# EAGLE design AutoPilotPanel - Part 2 (EAGLE 8.3.1)
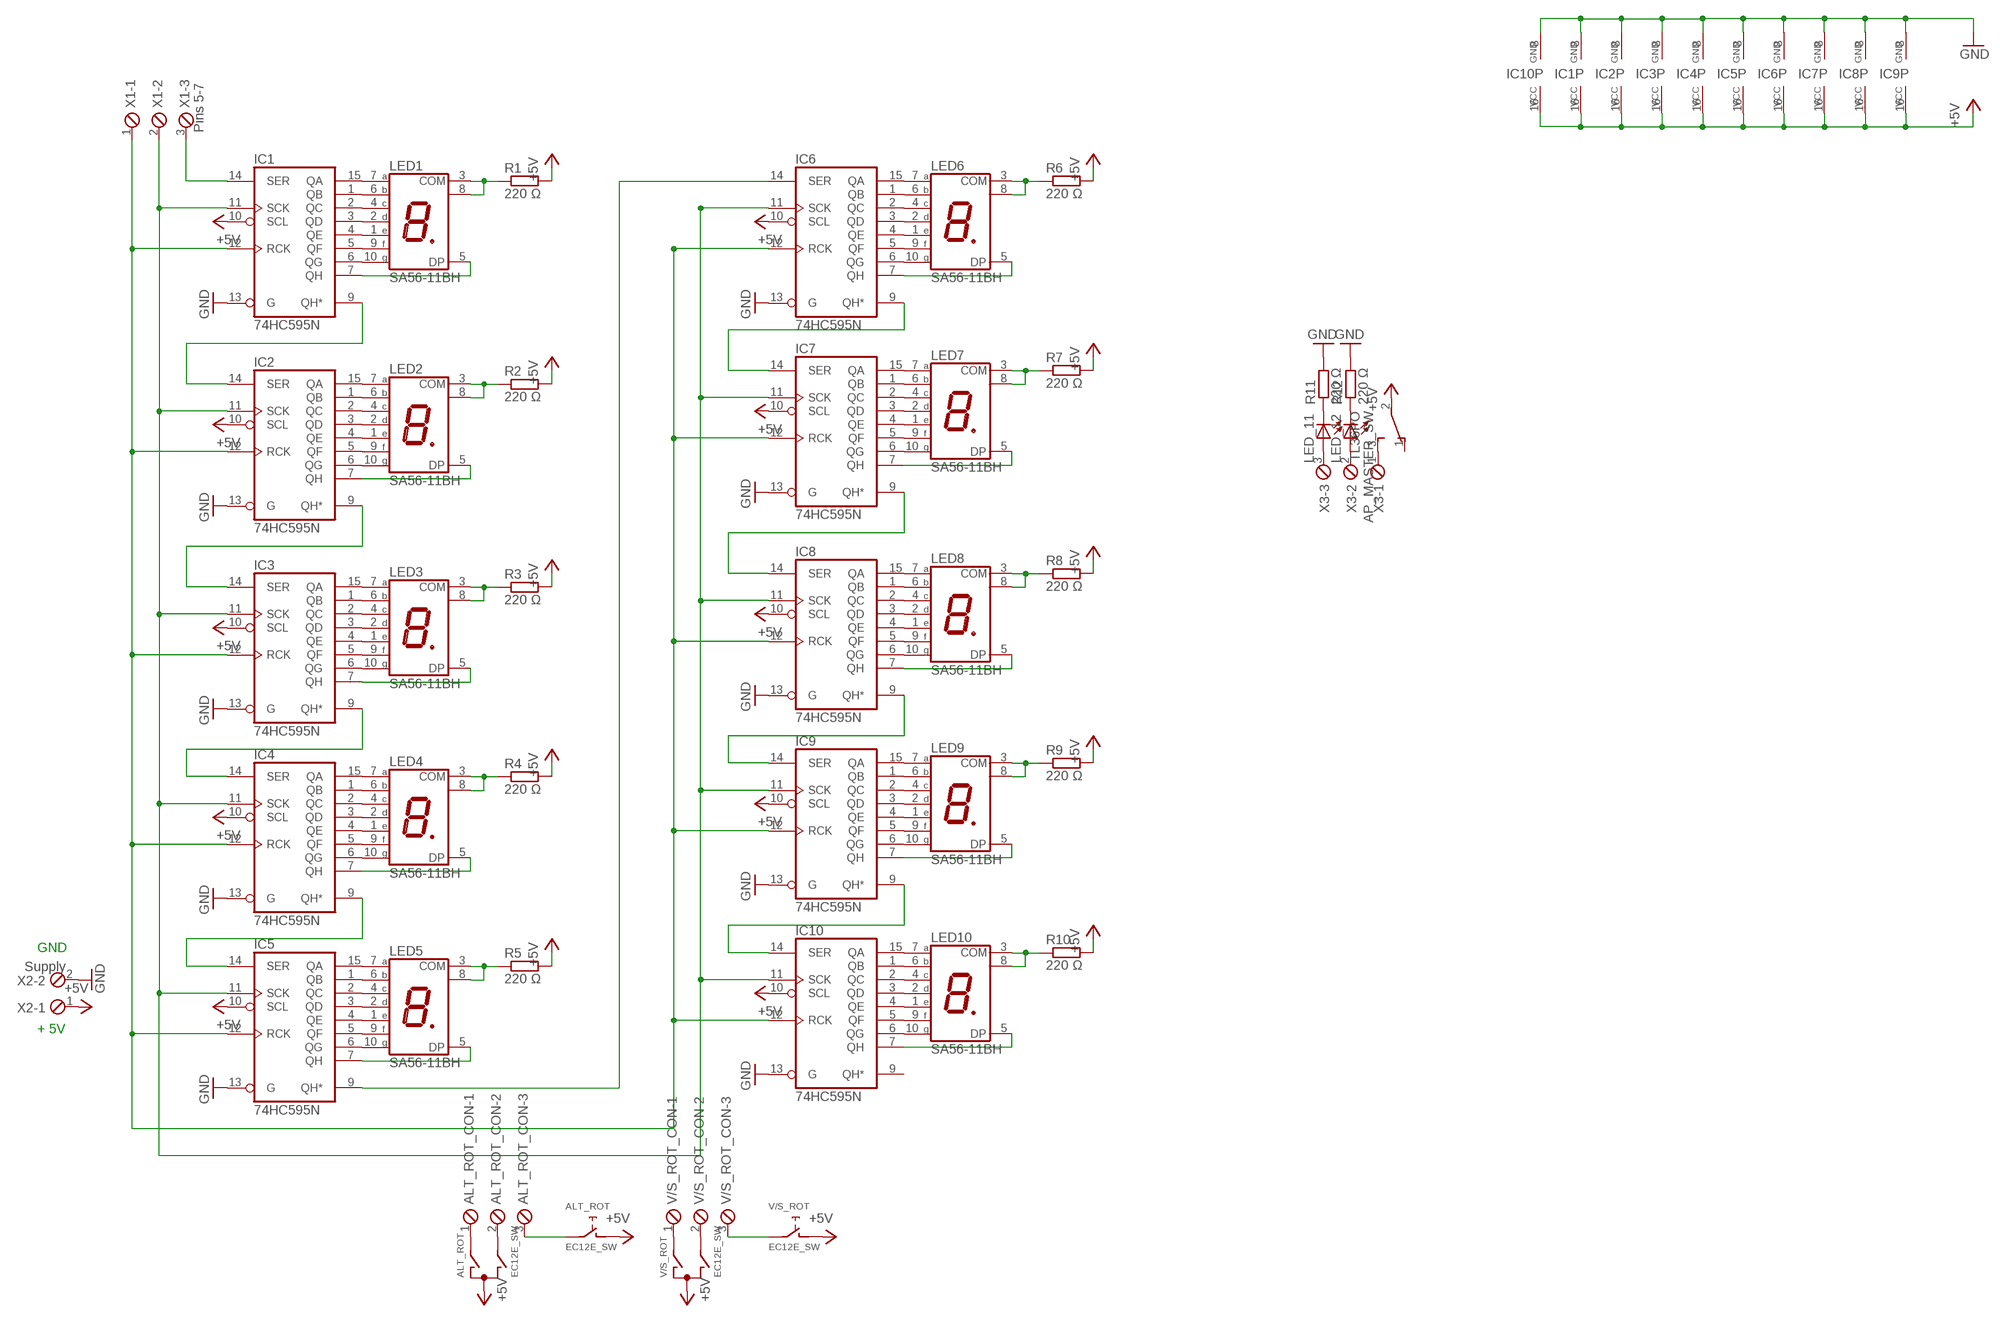
[diagram p0: schematic, sheet 1]

## Parts
ALT_ROT  EC12E_SW  [ALPS_EC12E_SW]
ALT_ROT_CON  MPT3  [3POL254]
AP_MASTER_SW  TL36PO  [TL3XPO]
IC1  74HC595N  [DIL16]
IC2  74HC595N  [DIL16]
IC3  74HC595N  [DIL16]
IC4  74HC595N  [DIL16]
IC5  74HC595N  [DIL16]
IC6  74HC595N  [DIL16]
IC7  74HC595N  [DIL16]
IC8  74HC595N  [DIL16]
IC9  74HC595N  [DIL16]
IC10  74HC595N  [DIL16]
LED1  SA56-11BH  7-SEG_SA56-11  [SA56-11]
LED2  SA56-11BH  7-SEG_SA56-11  [SA56-11]
LED3  SA56-11BH  7-SEG_SA56-11  [SA56-11]
LED4  SA56-11BH  7-SEG_SA56-11  [SA56-11]
LED5  SA56-11BH  7-SEG_SA56-11  [SA56-11]
LED6  SA56-11BH  7-SEG_SA56-11  [SA56-11]
LED7  SA56-11BH  7-SEG_SA56-11  [SA56-11]
LED8  SA56-11BH  7-SEG_SA56-11  [SA56-11]
LED9  SA56-11BH  7-SEG_SA56-11  [SA56-11]
LED10  SA56-11BH  7-SEG_SA56-11  [SA56-11]
LED_11  LED5MM  [LED5MM]
LED_12  LED5MM  [LED5MM]
R1  220 Ω  R-EU_0207/12  [0207/12]
R2  220 Ω  R-EU_0207/12  [0207/12]
R3  220 Ω  R-EU_0207/12  [0207/12]
R4  220 Ω  R-EU_0207/12  [0207/12]
R5  220 Ω  R-EU_0207/12  [0207/12]
R6  220 Ω  R-EU_0207/12  [0207/12]
R7  220 Ω  R-EU_0207/12  [0207/12]
R8  220 Ω  R-EU_0207/12  [0207/12]
R9  220 Ω  R-EU_0207/12  [0207/12]
R10  220 Ω  R-EU_0207/12  [0207/12]
R11  220 Ω  R-EU_0207/12  [0207/12]
R12  220 Ω  R-EU_0207/12  [0207/12]
V/S_ROT  EC12E_SW  [ALPS_EC12E_SW]
V/S_ROT_CON  MPT3  [3POL254]
X1  Pins 5-7  MPT3  [3POL254]
X2  Supply  MPT2  [2POL254]
X3  MPT3  [3POL254]

## Nets
+5V: ALT_ROT.C ALT_ROT.D AP_MASTER_SW.2(P) IC1.10(SCL) IC1.16(VCC) IC2.10(SCL) IC2.16(VCC) IC3.10(SCL) IC3.16(VCC) IC4.10(SCL) IC4.16(VCC) IC5.10(SCL) IC5.16(VCC) IC6.10(SCL) IC6.16(VCC) IC7.10(SCL) IC7.16(VCC) IC8.10(SCL) IC8.16(VCC) IC9.10(SCL) IC9.16(VCC) IC10.10(SCL) IC10.16(VCC) R1.2 R2.2 R3.2 R4.2 R5.2 R6.2 R7.2 R8.2 R9.2 R10.2 V/S_ROT.C V/S_ROT.D X2.1
GND: IC1.8(GND) IC1.13(G) IC2.8(GND) IC2.13(G) IC3.8(GND) IC3.13(G) IC4.8(GND) IC4.13(G) IC5.8(GND) IC5.13(G) IC6.8(GND) IC6.13(G) IC7.8(GND) IC7.13(G) IC8.8(GND) IC8.13(G) IC9.8(GND) IC9.13(G) IC10.8(GND) IC10.13(G) R11.2 R12.2 X2.2
N$1: IC1.5(QF) LED1.9(F)
N$2: IC1.3(QD) LED1.2(D)
N$3: IC1.1(QB) LED1.6(B)
N$4: IC1.15(QA) LED1.7(A)
N$5: IC1.2(QC) LED1.4(C)
N$6: IC1.4(QE) LED1.1(E)
N$7: IC1.6(QG) LED1.10(G)
N$8: IC2.5(QF) LED2.9(F)
N$9: IC1.7(QH) LED1.5(DP)
N$10: IC2.3(QD) LED2.2(D)
N$11: IC2.1(QB) LED2.6(B)
N$12: IC1.14(SER) X1.3
N$13: IC1.11(SCK) IC2.11(SCK) IC3.11(SCK) IC4.11(SCK) IC5.11(SCK) IC6.11(SCK) IC7.11(SCK) IC8.11(SCK) IC9.11(SCK) IC10.11(SCK) X1.2
N$14: IC1.12(RCK) IC2.12(RCK) IC3.12(RCK) IC4.12(RCK) IC5.12(RCK) IC6.12(RCK) IC7.12(RCK) IC8.12(RCK) IC9.12(RCK) IC10.12(RCK) X1.1
N$15: LED1.3(COM) LED1.8(COM) R1.1
N$16: IC2.15(QA) LED2.7(A)
N$17: IC2.2(QC) LED2.4(C)
N$18: IC2.4(QE) LED2.1(E)
N$19: IC2.6(QG) LED2.10(G)
N$20: IC3.5(QF) LED3.9(F)
N$21: IC3.3(QD) LED3.2(D)
N$22: IC2.7(QH) LED2.5(DP)
N$23: IC1.9(QH*) IC2.14(SER)
N$24: IC3.1(QB) LED3.6(B)
N$25: IC3.15(QA) LED3.7(A)
N$26: LED2.3(COM) LED2.8(COM) R2.1
N$27: IC3.2(QC) LED3.4(C)
N$28: IC3.4(QE) LED3.1(E)
N$29: IC3.6(QG) LED3.10(G)
N$30: IC4.5(QF) LED4.9(F)
N$31: IC4.3(QD) LED4.2(D)
N$32: IC4.1(QB) LED4.6(B)
N$33: IC4.15(QA) LED4.7(A)
N$34: IC4.2(QC) LED4.4(C)
N$35: IC4.4(QE) LED4.1(E)
N$36: IC4.6(QG) LED4.10(G)
N$37: IC5.5(QF) LED5.9(F)
N$38: IC5.3(QD) LED5.2(D)
N$39: IC5.1(QB) LED5.6(B)
N$40: IC5.15(QA) LED5.7(A)
N$41: IC5.2(QC) LED5.4(C)
N$42: IC3.7(QH) LED3.5(DP)
N$43: IC2.9(QH*) IC3.14(SER)
N$44: IC5.4(QE) LED5.1(E)
N$45: IC5.6(QG) LED5.10(G)
N$46: LED3.3(COM) LED3.8(COM) R3.1
N$47: IC6.5(QF) LED6.9(F)
N$48: IC6.3(QD) LED6.2(D)
N$49: IC6.1(QB) LED6.6(B)
N$50: IC6.15(QA) LED6.7(A)
N$51: IC6.2(QC) LED6.4(C)
N$52: IC6.4(QE) LED6.1(E)
N$53: IC6.6(QG) LED6.10(G)
N$54: IC7.5(QF) LED7.9(F)
N$55: IC7.3(QD) LED7.2(D)
N$56: IC7.1(QB) LED7.6(B)
N$57: IC7.15(QA) LED7.7(A)
N$58: IC7.2(QC) LED7.4(C)
N$59: IC7.4(QE) LED7.1(E)
N$60: IC7.6(QG) LED7.10(G)
N$61: IC8.5(QF) LED8.9(F)
N$62: IC4.7(QH) LED4.5(DP)
N$63: IC3.9(QH*) IC4.14(SER)
N$64: IC8.3(QD) LED8.2(D)
N$65: IC8.1(QB) LED8.6(B)
N$66: LED4.3(COM) LED4.8(COM) R4.1
N$67: IC8.15(QA) LED8.7(A)
N$68: IC8.2(QC) LED8.4(C)
N$69: IC8.4(QE) LED8.1(E)
N$70: IC8.6(QG) LED8.10(G)
N$71: IC9.5(QF) LED9.9(F)
N$72: IC9.3(QD) LED9.2(D)
N$73: IC9.1(QB) LED9.6(B)
N$74: IC9.15(QA) LED9.7(A)
N$75: IC9.2(QC) LED9.4(C)
N$76: IC9.4(QE) LED9.1(E)
N$77: IC9.6(QG) LED9.10(G)
N$78: AP_MASTER_SW.3(S) X3.1
N$79: LED_12.A X3.2
N$80: LED_11.A X3.3
N$81: LED_11.K(C) R11.1
N$82: IC5.7(QH) LED5.5(DP)
N$83: IC4.9(QH*) IC5.14(SER)
N$84: LED_12.K(C) R12.1
N$86: LED5.3(COM) LED5.8(COM) R5.1
N$88: ALT_ROT.A ALT_ROT_CON.1
N$89: ALT_ROT.B ALT_ROT_CON.2
N$90: ALT_ROT.E ALT_ROT_CON.3
N$91: IC10.7(QH) LED10.5(DP)
N$92: IC9.9(QH*) IC10.14(SER)
N$93: LED10.3(COM) LED10.8(COM) R10.1
N$96: IC10.5(QF) LED10.9(F)
N$97: IC10.3(QD) LED10.2(D)
N$98: IC10.1(QB) LED10.6(B)
N$99: IC10.15(QA) LED10.7(A)
N$100: IC10.2(QC) LED10.4(C)
N$101: IC10.4(QE) LED10.1(E)
N$102: IC6.7(QH) LED6.5(DP)
N$103: IC5.9(QH*) IC6.14(SER)
N$104: IC10.6(QG) LED10.10(G)
N$106: LED6.3(COM) LED6.8(COM) R6.1
N$109: V/S_ROT.A V/S_ROT_CON.1
N$110: V/S_ROT.B V/S_ROT_CON.2
N$122: IC7.7(QH) LED7.5(DP)
N$123: IC6.9(QH*) IC7.14(SER)
N$126: LED7.3(COM) LED7.8(COM) R7.1
N$142: IC8.7(QH) LED8.5(DP)
N$143: IC7.9(QH*) IC8.14(SER)
N$146: LED8.3(COM) LED8.8(COM) R8.1
N$162: IC9.7(QH) LED9.5(DP)
N$163: IC8.9(QH*) IC9.14(SER)
N$166: LED9.3(COM) LED9.8(COM) R9.1
N$170: V/S_ROT.E V/S_ROT_CON.3
Unconnected: ALT_ROT.GND1(G) ALT_ROT.GND2(G) AP_MASTER_SW.1(O) IC10.9(QH*) V/S_ROT.GND1(G) V/S_ROT.GND2(G)

## Notes on the sheet
- GND
- + 5V

## Library data of the parts
ALT_ROT V/S_ROT = switch-alps:EC12E_SW: ALPS rotary Encoder EC12E series with switch; MPN: EC12E2424407; OC_FARNELL: 1520813; OC_NEWARK: 74M1068
ALT_ROT_CON V/S_ROT_CON X1 X3 = con-phoenix-254:MPT3: PHOENIX CONNECTOR; OC_FARNELL: unknown; OC_NEWARK: unknown
AP_MASTER_SW = switch:TL36PO: TINY SWITCH ON - ON Source: http://www2.produktinfo.conrad.com/datenblaetter/700000-724999/705152-da-01-de-Subminiaturschalter_TL_36YO.pdf
IC1-IC10 = 74xx-eu:74*595: 8-bit SHIFT REGISTER, output latch
LED1-LED10 = display-kingbright:7-SEG_: Kingbright 14.2mm (0.56 INCH) SINGLE DIGIT NUMERIC DUISPLAY Source: SA56-11EWA(Ver1189471036.pdf; OC_FARNELL: unknown; OC_NEWARK: unknown
LED_11 LED_12 = led:LED: LED OSRAM: - CHIPLED LG R971, LG N971, LY N971, LG Q971, LY Q971, LO R971, LY R971 LH N974, LH R974 LS Q976, LO Q976, LY Q976 LO Q996 - Hyper CHIPLED LW Q18S LB Q993, LB Q99A, LB R99A - SideLED LS A670, LO A670, LY A670, LG A670, LP A670 LB A673, LV A673, LT A673, LW A673 LH A674 LY A675 LS A676, LA A676, LO A676, LY A676, LW A676 LS A679, LY A679, LG A679 - Hyper Micro SIDELED® LS Y876, LA Y876, LO Y876, LY Y876 LT Y87S - SmartLED LW L88C, LW L88S LB L89C, LB L89S, LG L890 LS L89K, LO L89K, LY L89K LS L896, LA L896, LO L896, LY L896 - TOPLED LS T670, LO T670, LY T670, LG T670, LP T670 LSG T670, LSP T670, LSY T670, LOP T670, LYG T670 LG T671, LOG T671, LSG T671 LB T673, LV T673, LT T673, LW T673 LH T674 LS T676, LA T676, LO T676, LY T676, LB T676, LH T676, LSB T676, LW T676 LB T67C, LV T67C, LT T67C, LS T67K, LO T67K, LY T67K, LW E67C LS E67B, LA E67B, LO E67B, LY E67B, LB E67C, LV E67C, LT E67C LW T67C LS T679, LY T679, LG T679 LS T770, LO T770, LY T770, LG T770, LP T770 LB T773, LV T773, LT T773, LW T773 LH T774 LS E675, LA E675, LY E675, LS T675 LS T776, LA T776, LO T776, LY T776, LB T776 LHGB T686 LT T68C, LB T68C - Hyper Mini TOPLED® LB M676 - Mini TOPLED Santana® LG M470 LS M47K, LO M47K, LY M47K Source: http://www.osram.convergy.de LUXEON: - LUMILED® LXK2-PW12-R00, LXK2-PW12-S00, LXK2-PW14-U00, LXK2-PW14-V00 LXK2-PM12-R00, LXK2-PM12-S00, LXK2-PM14-U00 LXK2-PE12-Q00, LXK2-PE12-R00, LXK2-PE12-S00, LXK2-PE14-T00, LXK2-PE14-U00 LXK2-PB12-K00, LXK2-PB12-L00, LXK2-PB12-M00, LXK2-PB14-N00, LXK2-PB14-P00, LXK2-PB14-Q00 LXK2-PR12-L00, LXK2-PR12-M00, LXK2-PR14-Q00, LXK2-PR14-R00 LXK2-PD12-Q00, LXK2-PD12-R00, LXK2-PD12-S00 LXK2-PH12-R00, LXK2-PH12-S00 LXK2-PL12-P00, LXK2-PL12-Q00, LXK2-PL12-R00 Source: www.luxeon.com KINGBRIGHT: KA-3528ASYC Source: www.kingbright.com
R1-R12 = resistor:R-EU_: RESISTOR, European symbol
X2 = con-phoenix-254:MPT2: PHOENIX CONNECTOR; OC_FARNELL: unknown; OC_NEWARK: unknown

## Board
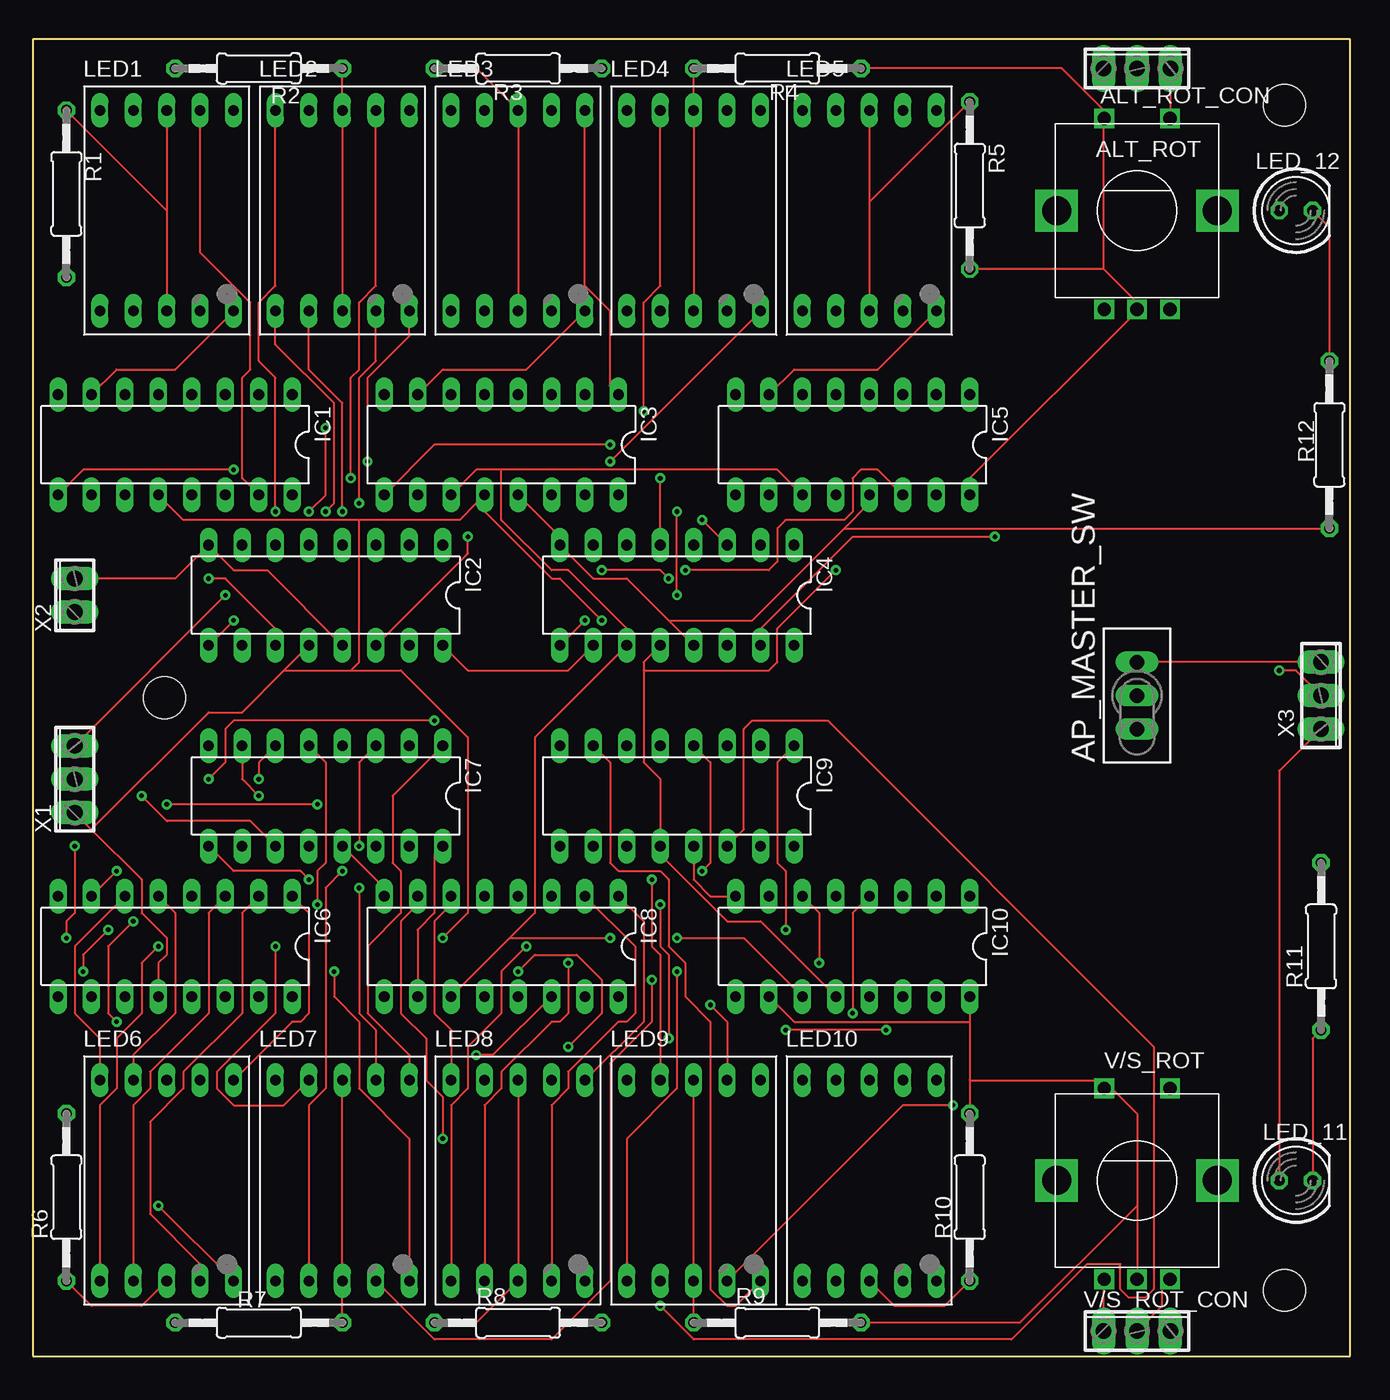
[diagram p1: board, top side]
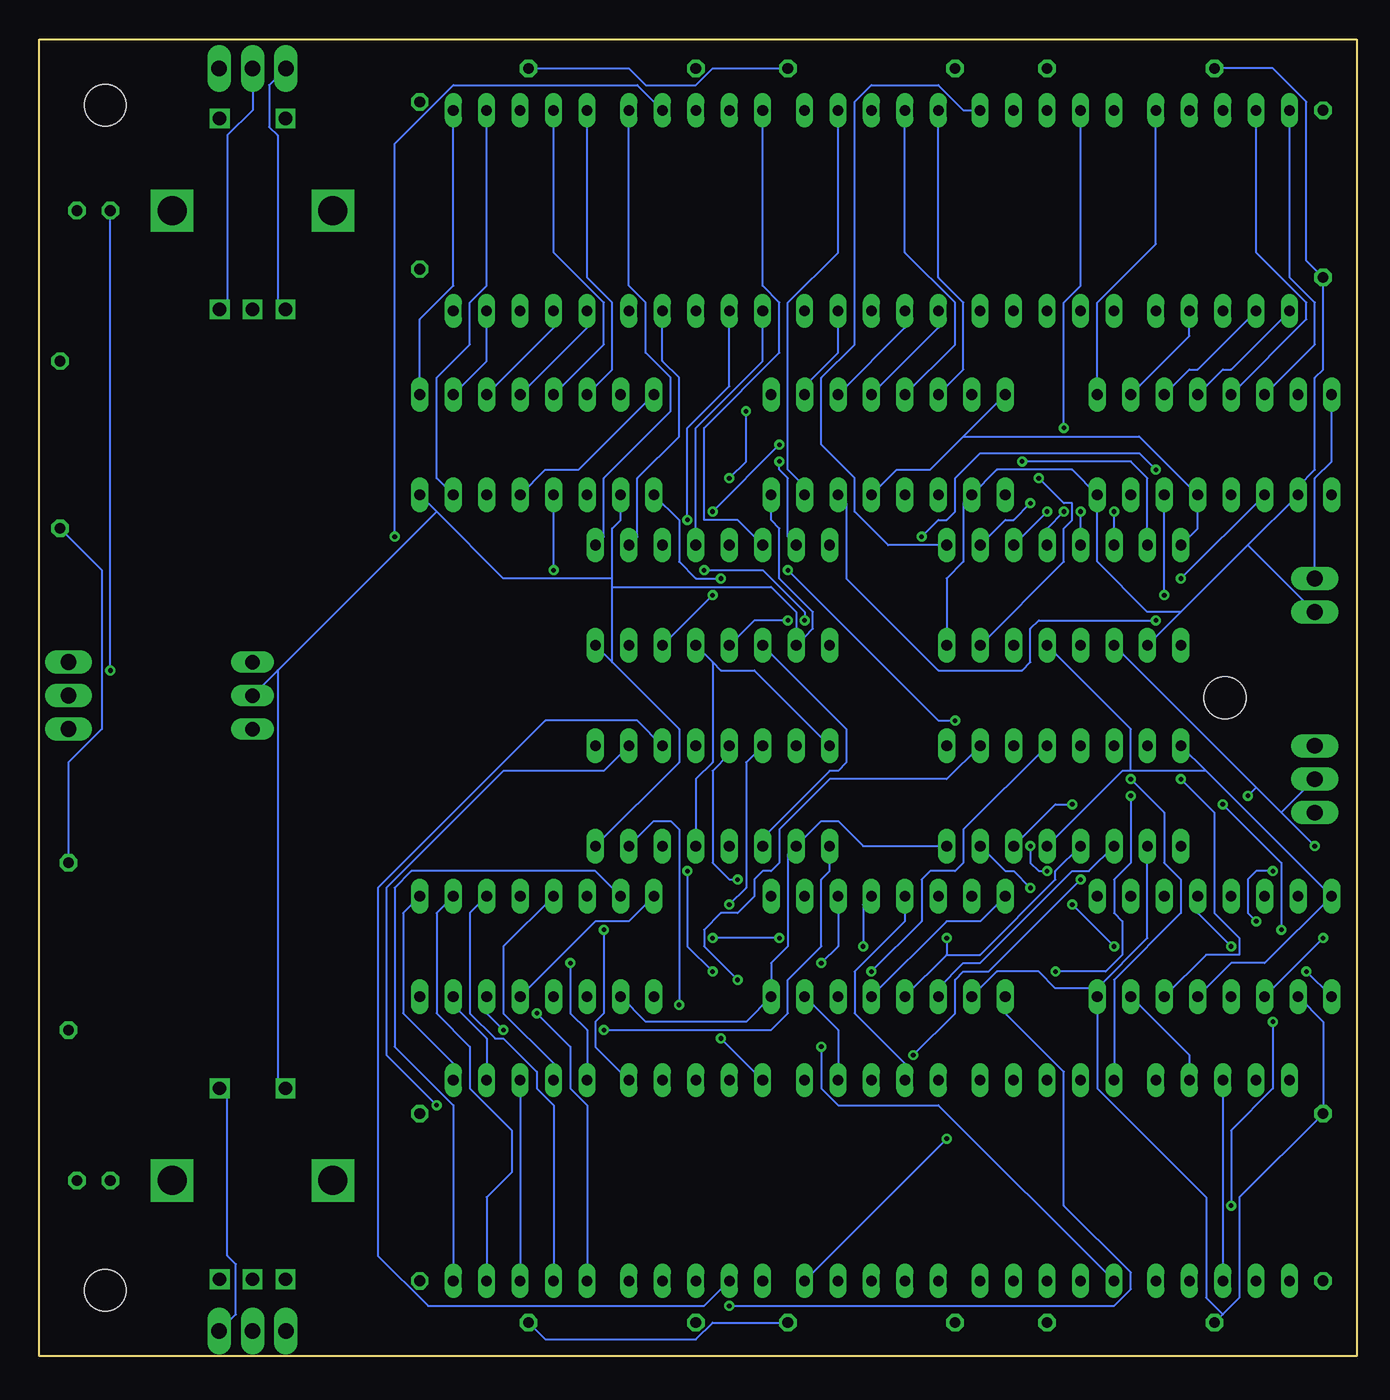
[diagram p2: board, bottom side, seen from below]

Size 100 x 100 mm. Coordinates in mm from the lower left corner, seen from the top.
Outline: 0,0 100,0 100,100 0,100 0,0
Copper layers (1*16): Top 0.035mm / dielectric 1.5mm / Bottom 0.035mm
Design rules "default": minimum track width 6mil, minimum drill 0.35mm, track to track 6mil, track to pad 6mil, pad to pad 6mil, via to via 6mil, smd to smd 6mil, copper to edge 40mil, drill to drill 6mil, minimum pad ring 10mil, minimum via ring 8mil, stop-mask expansion 4mil, vias tented up to drill 0mil, thermal gap 10mil
Holes 3.2 mm at 95,95 95,5 10,50

### Footprints (pad centres in the part's own frame; a part is rotated, then mirrored left to right if it is on the bottom)
ALPS_EC12E_SW = drill 1 square: A -2.5,-7.5; B 2.5,-7.5; C 0,-7.5; D -2.5,7; E 2.5,7 | drill 2.2 square: GND1 -6.1,0; GND2 6.1,0
3POL254 = drill 1.2 long: 1 -2.54,0; 2 0,0; 3 2.54,0
TL3XPO = drill 1.1 pad 1.422 long: 1 -2.54,0; 2 0,0; 3 2.54,0
DIL16 = drill 0.813 long: 1 -8.89,-3.81; 2 -6.35,-3.81; 3 -3.81,-3.81; 4 -1.27,-3.81; 5 1.27,-3.81; 6 3.81,-3.81; 7 6.35,-3.81; 8 8.89,-3.81; 9 8.89,3.81; 10 6.35,3.81; 11 3.81,3.81; 12 1.27,3.81; 13 -1.27,3.81; 14 -3.81,3.81; 15 -6.35,3.81; 16 -8.89,3.81
SA56-11 = drill 0.8 long: 1 -5.08,-7.62; 2 -2.54,-7.62; 3 0,-7.62; 4 2.54,-7.62; 5 5.08,-7.62; 6 5.08,7.62; 7 2.54,7.62; 8 0,7.62; 9 -2.54,7.62; 10 -5.08,7.62
LED5MM = drill 0.813 octagon: A -1.27,0; K 1.27,0
0207/12 = drill 0.813 octagon: 1 -6.35,0; 2 6.35,0
2POL254 = drill 1.2 long: 1 -1.27,0; 2 1.27,0

### Placement (x,y rotation side)
ALT_ROT  83.82,87 0 top
ALT_ROT_CON  83.82,97.79 0 top
AP_MASTER_SW  83.82,50.16 90 top
IC1  10.79,69.22 180 top
IC2  22.23,57.78 180 top
IC3  35.56,69.22 180 top
IC4  48.9,57.78 180 top
IC5  62.23,69.22 180 top
IC6  10.79,31.11 180 top
IC7  22.23,42.55 180 top
IC8  35.56,31.11 180 top
IC9  48.9,42.55 180 top
IC10  62.23,31.11 180 top
LED1  10.16,87 0 top
LED2  23.5,87 0 top
LED3  36.83,87 0 top
LED4  50.16,87 0 top
LED5  63.5,87 0 top
LED6  10.16,13.34 0 top
LED7  23.5,13.34 0 top
LED8  36.83,13.34 0 top
LED9  50.16,13.34 0 top
LED10  63.5,13.34 0 top
LED_11  95.89,13.34 0 top
LED_12  95.89,87 0 top
R1  2.54,88.27 270 top
R2  17.14,97.79 180 top
R3  36.83,97.79 0 top
R4  56.52,97.79 0 top
R5  71.12,88.9 270 top
R6  2.54,12.06 90 top
R7  17.14,2.54 180 top
R8  36.83,2.54 0 top
R9  56.52,2.54 0 top
R10  71.12,12.06 90 top
R11  97.79,31.11 90 top
R12  98.42,69.22 270 top
V/S_ROT  83.82,13.34 0 top
V/S_ROT_CON  83.82,1.91 0 top
X1  3.17,43.81 90 top
X2  3.17,57.78 90 top
X3  97.79,50.16 270 top

### Tracks (layer width: path | path; a pad name or v marks a point on that pad's centre or on a via)
+5V
  Top 0.152: IC10.16 71.12,25.4 | 71.12,25.4 71.12,20.95 | 71.12,20.95 R10.2 | 71.12,20.95 81.28,20.95 V/S_ROT.D 81.92,20.32 83.82,18.41 83.82,11.43 | 83.82,11.43 V/S_ROT.C | R9.2 74.93,2.54 83.82,11.43 | IC8.10 29.21,32.38 30.48,33.66 30.48,38.1 IC7.16 | 71.12,25.4 57.78,25.4 IC10.10 | IC4.10 40.64,52.07 33.02,52.07 IC2.16 | 81.28,82.55 R5.2 | 81.28,82.55 83.82,80.01 ALT_ROT.C 83.82,79.38 71.12,66.67 IC5.16 | 81.28,82.55 81.28,93.98 ALT_ROT.D 81.28,94.61 78.11,97.79 R4.2
  Bottom 0.152: R8.2 48.9,2.54 50.16,1.27 61.59,1.27 R9.2 | IC6.10 2.54,25.4 R6.2 8.89,12.06 8.89,4.45 10.16,3.17 | 10.16,3.17 R7.2 | IC7.10 15.88,31.75 19.68,27.94 | IC8.10 27.3,29.21 24.13,29.21 22.86,27.94 19.68,27.94 | 19.68,27.94 IC6.16 19.68,20.32 11.43,12.06 11.43,4.45 10.16,3.17 | IC7.16 37.47,38.73 39.37,40.64 40.64,40.64 IC9.10 43.18,38.1 43.18,31.11 44.45,29.84 IC8.16 46.35,25.4 53.98,25.4 IC10.10 | 8.26,61.59 IC1.10 4.45,66.04 3.17,67.31 3.17,74.3 2.54,74.93 R1.2 3.81,83.19 3.81,95.25 6.35,97.79 R2.2 | 8.26,61.59 13.34,56.52 | 13.34,56.52 IC2.10 | 13.34,56.52 15.88,56.52 19.68,60.33 IC1.16 21.59,67.31 27.3,67.31 IC3.10 29.84,64.77 29.84,60.33 31.11,59.05 IC2.16 | IC3.16 44.45,63.5 43.81,62.87 43.81,59.05 41.27,56.52 41.27,55.24 41.91,54.61 | 8.26,61.59 X2.1 | IC9.16 51.44,45.09 51.44,47.62 56.52,52.7 | IC4.16 56.52,52.7 | IC5.10 55.88,63.5 56.52,62.87 56.52,59.05 | 56.52,52.7 56.52,58.42 | 56.52,58.42 56.52,59.05 | 69.85,64.14 64.77,59.05 56.52,59.05 | 69.85,64.14 IC5.16 | 69.85,64.14 81.92,52.07 | 81.92,52.07 AP_MASTER_SW.2 | R3.2 48.9,97.79 50.16,96.52 53.98,96.52 55.24,97.79 R4.2 | 41.91,54.61 42.55,55.24 42.55,56.52 44.45,58.42 56.52,58.42 | 41.91,54.61 IC4.10 | 81.92,52.07 81.92,20.95 V/S_ROT.D
GND
  Top 0.152: IC2.13 17.78,59.69 15.24,59.69 IC2.8 10.79,59.05 X2.2 | IC7.13 26.67,35.56 IC8.8 | IC10.8 51.44,34.92 50.16,36.2 IC9.13 | IC3.13 40.01,62.23 IC4.8 42.55,59.05 45.09,59.05 48.26,55.88 | 48.26,55.88 IC4.13 | IC5.13 63.5,64.77 61.59,62.87 | 61.59,62.87 54.61,55.88 48.26,55.88 | 61.59,62.87 R12.2
  Bottom 0.152: IC1.8 1.91,67.94 3.17,66.67 X2.2 | IC2.8 12.06,62.87 IC1.13 16.51,69.85 29.84,69.85 | IC8.13 31.11,33.02 28.57,33.02 IC8.8 | IC7.8 11.43,44.45 | 11.43,44.45 IC6.8 6.99,29.84 9.53,29.84 IC6.13 | IC7.13 17.78,44.45 17.14,44.45 | 11.43,44.45 17.14,44.45 | IC2.13 17.14,47.62 17.14,44.45 | R11.2 97.79,45.09 95.25,47.62 95.25,59.69 R12.2 | IC10.13 57.78,33.02 55.24,33.02 IC10.8 | IC5.8 59.05,67.31 61.59,67.31 IC5.13 | IC9.8 45.72,52.07 48.26,52.07 48.9,52.7 | IC4.13 48.9,52.7 | 29.84,69.85 32.38,67.31 34.92,67.31 IC3.13 | 29.84,69.85 IC3.8 | IC9.13 50.16,43.81 48.9,45.09 48.9,52.7
N$1
  Bottom 0.152: LED1.9 7.62,83.82 3.81,80.01 3.81,78.74 IC1.5
N$2
  Bottom 0.152: LED1.2 12.06,74.93 12.7,74.93 IC1.3
N$3
  Bottom 0.152: LED1.6 15.24,84.45 19.68,80.01 IC1.1
N$4
  Top 0.152: LED1.7 12.7,83.82 16.51,80.01 16.51,74.93 15.88,74.3 15.88,66.67 IC1.15
N$5
  Bottom 0.152: LED1.4 12.7,77.47 IC1.2
N$6
  Bottom 0.152: LED1.1 9.53,74.93 10.16,74.93 IC1.4
N$7
  Bottom 0.152: LED1.10 5.08,81.92 3.17,80.01 3.17,76.83 IC1.6
N$8  (via drill 0.35)
  Top 0.152: v22.23,70.48 22.23,65.41 v20.95,64.14
  Bottom 0.152: LED2.9 20.95,81.28 22.23,80.01 v22.23,70.48 | IC2.5 v20.95,64.14
N$9
  Top 0.152: LED1.5 10.79,74.93 6.35,74.93 IC1.7
N$10  (via drill 0.35)
  Top 0.152: LED2.2 20.95,74.93 23.5,72.39 v23.5,64.14
  Bottom 0.152: IC2.3 v23.5,64.14
N$11
  Bottom 0.152: LED2.6 29.84,94.61 31.75,96.52 36.83,96.52 38.1,95.25 38.1,76.83 40.64,74.3 40.64,69.22 38.1,66.67 38.1,64.14 35.56,61.59 IC2.1
N$12  (via drill 0.35)
  Top 0.152: X1.3 v14.61,57.78
  Bottom 0.152: v14.61,57.78 IC1.14
N$13  (via drill 0.35)
  Top 0.152: v2.54,31.75 2.54,33.02 3.17,33.66 v3.17,38.73 | v13.34,59.05 14.61,59.05 18.41,55.24 IC2.11 | IC3.11 33.66,67.31 35.56,67.31 | 35.56,67.31 56.52,67.31 IC5.11 | 36.2,31.75 38.1,33.66 38.1,46.99 IC4.11 45.09,55.24 40.64,59.69 39.37,59.69 35.56,63.5 35.56,67.31 | 36.2,31.75 IC8.11 | IC10.11 53.98,31.75 v48.9,31.75 | 36.2,31.75 v43.81,31.75 | v8.26,42.55 10.16,40.64 16.51,40.64 IC7.11
  Bottom 0.152: v2.54,31.75 IC6.11 | IC2.11 7.62,43.18 | 7.62,43.18 5.71,41.27 | 5.71,41.27 v3.17,38.73 | v13.34,59.05 IC1.11 | 5.71,41.27 X1.2 | v43.81,31.75 v48.9,31.75 | IC7.11 20.32,36.83 21.59,36.83 28.57,29.84 29.84,29.84 31.75,27.94 IC8.11 | IC9.11 45.09,39.37 40.01,44.45 39.37,44.45 38.73,45.09 38.73,47.62 IC4.11 | v8.26,42.55 7.62,43.18
N$14  (via drill 0.35)
  Top 0.152: 46.35,52.07 46.35,52.7 IC4.12 | 46.35,52.07 46.35,45.09 47.62,43.81 IC9.12 47.62,38.1 52.7,33.02 55.24,33.02 IC10.12 | v60.96,59.69 56.52,55.24 56.52,52.7 55.88,52.07 46.35,52.07 | IC1.12 11.43,63.5 24.77,63.5 | 24.77,63.5 32.38,63.5 33.66,64.77 | IC6.12 9.53,29.84 10.16,30.48 10.16,31.75 8.26,33.66 8.26,36.2 4.45,40.01 | X1.1 4.45,40.01 | 19.05,52.07 15.88,48.9 13.34,48.9 4.45,40.01 | 19.05,52.07 IC2.12 | 24.77,63.5 24.77,52.7 24.13,52.07 | 19.05,52.07 24.13,52.07 | v31.11,31.75 33.02,33.66 33.02,46.99 27.94,52.07 24.13,52.07 | v43.18,55.88 40.01,59.05 39.37,59.05 33.66,64.77 | 33.66,64.77 IC3.12
  Bottom 0.152: v60.96,59.69 IC5.12 | IC7.12 22.86,36.83 22.86,36.2 28.57,30.48 31.11,30.48 | IC8.12 31.11,30.48 | v31.11,31.75 31.11,30.48 | IC4.12 45.72,55.88 v43.18,55.88
N$15
  Top 0.152: LED1.8 10.16,87 | 10.16,87 LED1.3 | 10.16,87 R1.1
N$16  (via drill 0.35)
  Top 0.152: LED2.7 26.04,81.28 24.77,80.01 24.77,74.93 24.13,74.3 v24.13,66.67
  Bottom 0.152: v24.13,66.67 22.23,64.77 21.59,64.77 21.59,63.5 22.23,62.87 22.23,60.33 IC2.15
N$17  (via drill 0.35)
  Top 0.152: LED2.4 26.04,75.56 24.77,74.3 v24.77,64.77
  Bottom 0.152: v24.77,64.77 26.04,63.5 26.67,63.5 IC2.2
N$18  (via drill 0.35)
  Top 0.152: LED2.1 18.41,76.83 22.86,72.39 22.86,64.77 v22.23,64.14
  Bottom 0.152: v22.23,64.14 23.5,62.87 IC2.4
N$19  (via drill 0.35)
  Top 0.152: LED2.10 18.41,81.28 17.14,80.01 17.14,75.56 18.41,74.3 v18.41,64.14
  Bottom 0.152: IC2.6 v18.41,64.14
N$20
  Bottom 0.152: LED3.9 34.29,83.82 30.48,80.01 30.48,76.83 IC3.5
N$21
  Bottom 0.152: LED3.2 34.29,78.11 IC3.3
N$22  (via drill 0.35)
  Top 0.152: LED2.5 28.57,77.47 25.4,74.3 v25.4,67.94
  Bottom 0.152: v25.4,67.94 17.14,67.94 15.88,66.67 IC2.7
N$23  (via drill 0.35)
  Top 0.152: IC1.9 3.81,67.31 v15.24,67.31 | v33.02,62.23 33.02,60.96 IC2.14
  Bottom 0.152: v15.24,67.31 16.51,68.58 28.57,68.58 30.48,66.67 30.48,64.14 31.11,63.5 31.75,63.5 v33.02,62.23
N$24
  Top 0.152: LED3.6 41.91,81.28 43.81,79.38 43.81,73.66 IC3.1
N$25
  Bottom 0.152: LED3.7 39.37,83.82 43.18,80.01 43.18,67.31 41.91,66.04 IC3.15
N$26
  Top 0.152: LED2.3 LED2.8 R2.1
N$27
  Bottom 0.152: LED3.4 39.37,76.2 41.91,73.66 IC3.2
N$28
  Bottom 0.152: LED3.1 31.75,78.11 IC3.4
N$29
  Bottom 0.152: LED3.10 31.75,81.92 29.84,80.01 29.84,74.93 IC3.6
N$30  (via drill 0.35)
  Top 0.152: LED4.9 47.62,81.28 46.35,80.01 v46.35,71.75 | IC4.5 v47.62,66.67
  Bottom 0.152: v46.35,71.75 46.35,67.94 v47.62,66.67
N$31  (via drill 0.35)
  Top 0.152: IC4.3 v50.8,63.5
  Bottom 0.152: LED4.2 47.62,73.66 50.8,70.48 v50.8,63.5
N$32
  Bottom 0.152: LED4.6 55.24,81.28 53.98,80.01 53.98,76.2 52.07,74.3 52.07,71.75 57.15,66.67 57.15,62.23 IC4.1
N$33  (via drill 0.35)
  Top 0.152: v73.03,62.23 62.23,62.23 55.24,55.24 IC4.15
  Bottom 0.152: LED4.7 54.61,96.52 68.58,96.52 73.03,92.08 v73.03,62.23
N$34
  Bottom 0.152: LED4.4 52.7,75.56 51.44,74.3 51.44,69.85 54.61,66.67 54.61,62.23 IC4.2
N$35
  Bottom 0.152: LED4.1 45.09,75.56 50.16,70.48 IC4.4
N$36
  Bottom 0.152: LED4.10 45.09,81.28 43.81,80.01 43.81,76.2 49.53,70.48 49.53,63.5 46.99,63.5 IC4.6
N$37
  Bottom 0.152: LED5.9 60.96,83.82 57.15,80.01 57.15,76.83 IC5.5
N$38
  Bottom 0.152: LED5.2 60.96,78.11 IC5.3
N$39
  Bottom 0.152: LED5.6 68.58,81.28 71.12,78.74 IC5.1
N$40
  Bottom 0.152: LED5.7 66.04,81.28 67.31,80.01 67.31,76.83 69.85,74.3 69.85,66.67 IC5.15
N$41
  Bottom 0.152: LED5.4 66.04,75.56 IC5.2
N$42
  Top 0.152: LED3.5 37.47,74.93 31.11,74.93 IC3.7
N$43  (via drill 0.35)
  Top 0.152: v15.24,55.88 IC2.9
  Bottom 0.152: v15.24,55.88 24.13,55.88 24.77,55.24 24.77,52.7 25.4,52.07 31.75,52.07 38.73,59.05 38.73,64.77 IC3.14
N$44
  Bottom 0.152: LED5.1 58.42,78.11 IC5.4
N$45
  Bottom 0.152: LED5.10 58.42,81.92 56.52,80.01 56.52,74.93 IC5.6
N$46
  Top 0.152: LED3.3 LED3.8 33.66,97.79 R3.1
N$47
  Top 0.152: LED6.9 7.62,22.86 10.79,26.04 10.79,33.66 IC6.5
N$48
  Top 0.152: LED6.2 7.62,19.05 8.89,20.32 8.89,21.59 13.34,26.04 13.34,33.66 IC6.3
N$49
  Top 0.152: LED6.6 19.68,25.4 20.32,25.4 20.95,26.04 20.95,33.66 IC6.1
N$50
  Bottom 0.152: LED6.7 12.7,22.86 IC6.15
N$51
  Top 0.152: LED6.4 12.7,6.99 8.89,10.79 8.89,17.78 11.43,20.32 11.43,21.59 15.88,26.04 15.88,33.66 IC6.2
N$52  (via drill 0.35)
  Top 0.152: LED6.1 5.08,19.05 6.35,20.32 6.35,24.13 8.26,26.04 8.26,29.84 v9.53,31.11
  Bottom 0.152: v9.53,31.11 12.06,33.66 IC6.4
N$53
  Top 0.152: LED6.10 5.08,24.13 3.17,26.04 3.17,31.11 IC6.6
N$54  (via drill 0.35)
  Top 0.152: LED7.9 19.05,19.05 15.24,19.05 13.97,20.32 13.97,21.59 18.41,26.04 v18.41,31.11 | v21.59,34.29 21.59,36.83 22.23,37.47 22.23,45.09 IC7.5
  Bottom 0.152: v21.59,34.29 v18.41,31.11
N$55  (via drill 0.35)
  Top 0.152: LED7.2 20.95,19.05 22.23,20.32 22.23,35.56 v23.5,36.83 | v24.77,38.73 24.77,45.09 IC7.3
  Bottom 0.152: v23.5,36.83 24.13,36.83 24.77,37.47 v24.77,38.73
N$56
  Top 0.152: LED7.6 28.57,22.86 25.4,26.04 25.4,31.11 27.94,33.66 27.94,36.83 27.3,37.47 27.3,42.55 IC7.1
N$57  (via drill 0.35)
  Top 0.152: LED7.7 26.04,24.77 24.77,26.04 v24.77,35.56
  Bottom 0.152: v24.77,35.56 26.04,36.83 26.67,36.83 IC7.15
N$58  (via drill 0.35)
  Top 0.152: LED7.4 30.48,1.27 39.37,1.27 43.81,5.71 43.81,22.23 46.99,25.4 v46.99,28.57
  Bottom 0.152: v46.99,28.57 49.53,31.11 49.53,32.38 48.26,33.66 46.99,33.66 45.72,34.92 45.72,36.2 45.09,36.83 44.45,36.83 43.81,37.47 43.81,40.01 40.01,43.81 31.11,43.81 IC7.2
N$59  (via drill 0.35)
  Top 0.152: v40.64,23.5 43.18,26.04 43.18,28.57 41.27,30.48 38.1,30.48 v36.83,29.21
  Bottom 0.152: LED7.1 31.75,19.05 39.37,19.05 40.64,20.32 v40.64,23.5 | v36.83,29.21 33.02,33.02 33.02,36.2 32.38,36.83 30.48,36.83 29.84,37.47 29.84,40.01 IC7.4
N$60  (via drill 0.35)
  Top 0.152: v17.14,43.81 17.14,45.09 IC7.6
  Bottom 0.152: LED7.10 18.41,28.57 13.34,33.66 13.34,36.2 14.61,37.47 14.61,41.27 v17.14,43.81
N$61
  Bottom 0.152: LED8.9 34.29,22.23 38.1,26.04 38.1,29.21 34.29,33.02 IC8.5
N$62  (via drill 0.35)
  Top 0.152: v43.81,67.94 LED4.5
  Bottom 0.152: v43.81,67.94 43.81,67.31 43.18,66.67 43.18,62.23 IC4.7
N$63  (via drill 0.35)
  Top 0.152: IC3.9 30.48,69.22 v43.81,69.22 | v48.9,57.78 v48.9,64.14
  Bottom 0.152: v48.9,64.14 v43.81,69.22 | IC4.14 v48.9,57.78
N$64  (via drill 0.35)
  Top 0.152: LED8.2 34.29,19.05 35.56,20.32 35.56,21.59 39.37,25.4 40.01,25.4 40.64,26.04 v40.64,29.84
  Bottom 0.152: v40.64,29.84 39.37,31.11 IC8.3
N$65
  Top 0.152: LED8.6 46.35,25.4 46.35,33.02 IC8.1
N$66
  Top 0.152: LED4.3 LED4.8 R4.1
N$67
  Bottom 0.152: LED8.7 39.37,24.77 IC8.15
N$68
  Top 0.152: LED8.4 39.37,19.05 40.64,20.32 40.64,21.59 44.45,25.4 45.09,25.4 45.72,26.04 45.72,31.11 IC8.2
N$69  (via drill 0.35)
  Top 0.152: LED8.1 31.75,19.05 33.02,20.32 33.02,23.5 35.56,26.04 35.56,29.21 v37.47,31.11
  Bottom 0.152: v37.47,31.11 37.47,34.29 IC8.4
N$70
  Top 0.152: LED8.10 31.75,24.77 30.48,26.04 30.48,33.02 31.75,34.29 IC8.6
N$71  (via drill 0.35)
  Top 0.152: LED9.9 47.62,30.48 46.99,31.11 v46.99,36.2
  Bottom 0.152: v46.99,36.2 47.62,36.2 48.9,37.47 48.9,44.45 47.62,45.72 IC9.5
N$72
  Bottom 0.152: LED9.2 49.53,3.81 70.48,3.81 74.3,7.62 74.3,35.56 61.59,48.26 54.61,48.26 IC9.3
N$73  (via drill 0.35)
  Top 0.152: v57.15,32.38 57.15,36.83 56.52,37.47 56.52,45.09 IC9.1
  Bottom 0.152: LED9.6 57.78,23.5 57.78,25.4 57.15,26.04 v57.15,32.38
N$74  (via drill 0.35)
  Top 0.152: LED9.7 52.7,25.4 v51.44,26.67
  Bottom 0.152: v51.44,26.67 51.44,40.01 52.07,40.64 53.34,40.64 IC9.15
N$75  (via drill 0.35)
  Top 0.152: LED9.4 66.04,19.05 v69.85,19.05
  Bottom 0.152: v69.85,19.05 73.66,22.86 73.66,35.56 64.77,44.45 57.15,44.45 IC9.2
N$76  (via drill 0.35)
  Top 0.152: LED9.1 45.09,16.51 48.9,20.32 v48.9,29.21 | v50.8,36.83 51.44,37.47 51.44,45.09 IC9.4
  Bottom 0.152: v48.9,29.21 50.8,31.11 v50.8,36.83
N$77  (via drill 0.35)
  Top 0.152: v48.26,24.13 48.26,30.48 47.62,31.11 v47.62,34.29
  Bottom 0.152: v48.26,24.13 LED9.10 | v47.62,34.29 46.35,35.56 46.35,45.09 IC9.6
N$78
  Top 0.152: X3.1 AP_MASTER_SW.3
N$79  (via drill 0.35)
  Top 0.152: v94.61,52.07 95.89,52.07 X3.2
  Bottom 0.152: v94.61,52.07 LED_12.A
N$80
  Top 0.152: LED_11.A 94.61,44.45 X3.3
N$81
  Top 0.152: LED_11.K 97.16,24.13 R11.1
N$82
  Top 0.152: LED5.5 64.14,74.93 57.78,74.93 IC5.7
N$83  (via drill 0.35)
  Top 0.152: v41.91,55.88 IC4.9 | v49.53,59.69 55.88,59.69 56.52,60.33 56.52,62.87 57.15,63.5 61.59,63.5 62.23,64.14 62.23,66.67 62.87,67.31 64.14,67.31 IC5.14
  Bottom 0.152: v41.91,55.88 41.91,56.52 45.09,59.69 v49.53,59.69
N$84
  Top 0.152: R12.1 98.42,85.72 LED_12.K
N$86
  Top 0.152: LED5.8 63.5,87.63 | 63.5,87.63 LED5.3 | 63.5,87.63 R5.1
N$88
  Bottom 0.152: ALT_ROT_CON.1 82.55,96.52 82.55,93.34 81.92,92.71 81.92,80.01 ALT_ROT.A
N$89
  Bottom 0.152: ALT_ROT_CON.2 83.82,94.61 85.72,92.71 85.72,80.01 ALT_ROT.B
N$90
  Top 0.152: ALT_ROT_CON.3 86.36,94.61 ALT_ROT.E
N$91
  Bottom 0.152: LED10.5 68.58,19.05 73.03,23.5 73.03,35.56 71.75,36.83 57.78,36.83 IC10.7
N$92  (via drill 0.35)
  Top 0.152: v64.77,24.77 v57.15,24.77
  Bottom 0.152: IC9.9 40.01,36.83 40.64,36.2 40.64,31.11 43.18,28.57 43.18,26.04 44.45,24.77 v57.15,24.77 | v64.77,24.77 66.04,26.04 IC10.14
N$93
  Top 0.152: R10.1 69.22,3.81 65.41,3.81 LED10.3
  Bottom 0.152: LED10.8 LED10.3
N$96
  Bottom 0.152: LED10.9 60.96,22.23 64.77,26.04 64.77,31.11 IC10.5
N$97
  Bottom 0.152: LED10.2 60.96,19.05 62.23,20.32 62.23,21.59 64.77,24.13 65.41,24.13 67.31,26.04 67.31,33.66 IC10.3
N$98
  Bottom 0.152: LED10.6 68.58,22.23 72.39,26.04 72.39,33.66 IC10.1
N$99
  Bottom 0.152: LED10.7 66.04,24.13 68.58,26.67 IC10.15
N$100
  Bottom 0.152: LED10.4 66.04,12.06 64.14,13.97 64.14,17.14 67.31,20.32 67.31,23.5 69.85,26.04 69.85,33.66 IC10.2
N$101  (via drill 0.35)
  Top 0.152: v62.23,26.04 62.23,33.66 IC10.4
  Bottom 0.152: LED10.1 58.42,19.05 59.69,20.32 59.69,23.5 v62.23,26.04
N$102  (via drill 0.35)
  Top 0.152: v9.53,11.43 LED6.5 | v6.35,25.4 5.71,26.04 5.71,31.11 v7.62,33.02 | IC6.7 v6.35,36.83
  Bottom 0.152: v9.53,11.43 9.53,17.14 6.35,20.32 v6.35,25.4 | v7.62,33.02 8.26,33.66 8.26,36.2 7.62,36.83 v6.35,36.83
N$103  (via drill 0.35)
  Top 0.152: v13.34,43.81 14.61,45.09 14.61,47.62 15.24,48.26 v30.48,48.26 | v43.18,59.69 47.62,59.69 v48.26,59.05
  Bottom 0.152: IC6.14 11.43,30.48 8.89,30.48 8.89,31.75 10.79,33.66 10.79,41.27 v13.34,43.81 | v30.48,48.26 31.75,48.26 v43.18,59.69 | v48.26,59.05 50.16,59.05 51.44,60.33 51.44,63.5 IC5.9
N$104  (via drill 0.35)
  Top 0.152: v59.69,29.84 59.69,33.66 IC10.6
  Bottom 0.152: LED10.10 58.42,24.77 59.69,26.04 v59.69,29.84
N$106
  Top 0.152: R6.1 4.45,3.81 8.26,3.81 LED6.3
  Bottom 0.152: LED6.8 LED6.3
N$109
  Top 0.152: V/S_ROT_CON.1 81.28,5.71 V/S_ROT.A
N$110
  Top 0.152: V/S_ROT_CON.2 85.72,3.81 85.72,5.71 V/S_ROT.B
N$122  (via drill 0.35)
  Top 0.152: LED7.5 28.57,16.51 24.77,20.32 24.77,25.4 22.86,27.3 v22.86,29.21 | v17.14,42.55 15.88,43.81 IC7.7
  Bottom 0.152: v22.86,29.21 19.05,29.21 17.78,30.48 17.78,33.02 18.41,33.66 18.41,36.2 17.14,37.47 v17.14,42.55
N$123  (via drill 0.35)
  Top 0.152: v3.81,29.21 3.81,30.48 v5.71,32.38 | v21.59,41.91 v10.16,41.91
  Bottom 0.152: v3.81,29.21 IC6.9 | v5.71,32.38 5.71,37.47 v10.16,41.91 | v21.59,41.91 22.86,41.91 IC7.14
N$126
  Top 0.152: R7.1 LED7.3 LED7.8
N$142  (via drill 0.35)
  Top 0.152: v31.11,16.51 31.11,19.68 29.84,20.95 29.84,24.13 27.94,26.04 27.94,33.02 29.21,34.29 IC8.7
  Bottom 0.152: v31.11,16.51 LED8.5
N$143  (via drill 0.35)
  Top 0.152: IC7.9 15.24,36.83 20.32,36.83 v20.95,36.2 | v33.66,22.86 34.92,22.86 IC8.14
  Bottom 0.152: v20.95,36.2 27.94,29.21 29.84,29.21 30.48,28.57 30.48,26.04 v33.66,22.86
N$146
  Top 0.152: LED8.8 LED8.3 33.66,2.54 R8.1
N$162
  Top 0.152: LED9.5 53.34,3.81 52.7,3.81 51.44,5.08 51.44,25.4 49.53,27.3 49.53,29.84 48.26,31.11 48.26,36.2 47.62,36.83 44.45,36.83 43.81,37.47 43.81,45.09 IC9.7
N$163  (via drill 0.35)
  Top 0.152: v47.62,3.81 50.16,1.27 74.3,1.27 80.01,6.99 82.55,6.99 82.55,5.08 83.19,4.45 84.45,4.45 85.09,5.08 85.09,23.5 60.33,48.26 54.61,48.26 53.98,47.62 53.98,40.01 IC9.14
  Bottom 0.152: IC8.9 26.67,26.04 22.23,21.59 22.23,11.43 17.14,6.35 17.14,5.08 18.41,3.81 v47.62,3.81
N$166
  Top 0.152: R9.1 LED9.3 LED9.8
N$170
  Bottom 0.152: V/S_ROT_CON.3 85.09,3.17 85.09,6.99 85.72,7.62 85.72,20.32 V/S_ROT.E